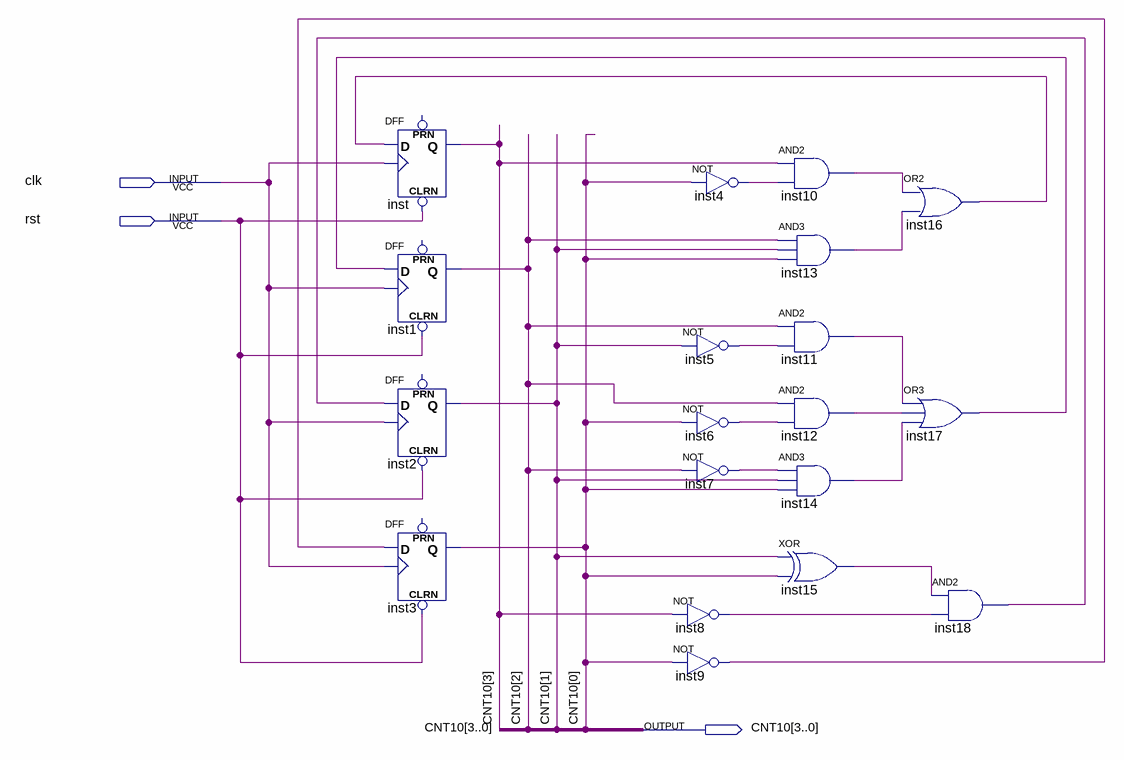
[diagram p0: schematic sheet]
// Quartus schematic ten_counter.bdf as structural Verilog: 19 symbols, 3 pins
module ten_counter (
  input  clk,
  input  rst,
  output [3:0] CNT10
);

  wire inst4_out, inst5_out, inst6_out, inst7_out, inst8_out, inst9_out, inst10_out, inst11_out, inst12_out,
       inst13_out, inst14_out, inst15_out, inst16_out, inst17_out, inst18_out;

  DFF inst (.CLRN(rst), .CLK(clk), .D(inst16_out), .Q(CNT10[3]));  // open: PRN
  DFF inst1 (.CLRN(rst), .CLK(clk), .D(inst17_out), .Q(CNT10[2]));  // open: PRN
  DFF inst2 (.CLRN(rst), .CLK(clk), .D(inst18_out), .Q(CNT10[1]));  // open: PRN
  DFF inst3 (.CLRN(rst), .CLK(clk), .D(inst9_out), .Q(CNT10[0]));  // open: PRN
  not inst4 (inst4_out, CNT10[0]);
  not inst5 (inst5_out, CNT10[1]);
  not inst6 (inst6_out, CNT10[0]);
  not inst7 (inst7_out, CNT10[2]);
  not inst8 (inst8_out, CNT10[3]);
  not inst9 (inst9_out, CNT10[0]);
  and inst10 (inst10_out, CNT10[3], inst4_out);
  and inst13 (inst13_out, CNT10[2], CNT10[1], CNT10[0]);
  and inst11 (inst11_out, CNT10[2], inst5_out);
  and inst12 (inst12_out, CNT10[2], inst6_out);
  and inst14 (inst14_out, inst7_out, CNT10[1], CNT10[0]);
  xor inst15 (inst15_out, CNT10[1], CNT10[0]);
  or inst16 (inst16_out, inst10_out, inst13_out);
  or inst17 (inst17_out, inst11_out, inst12_out, inst14_out);
  and inst18 (inst18_out, inst15_out, inst8_out);
endmodule
